# Altium schematic sheet ife18_TS_BMS_Master.SchDoc
size A
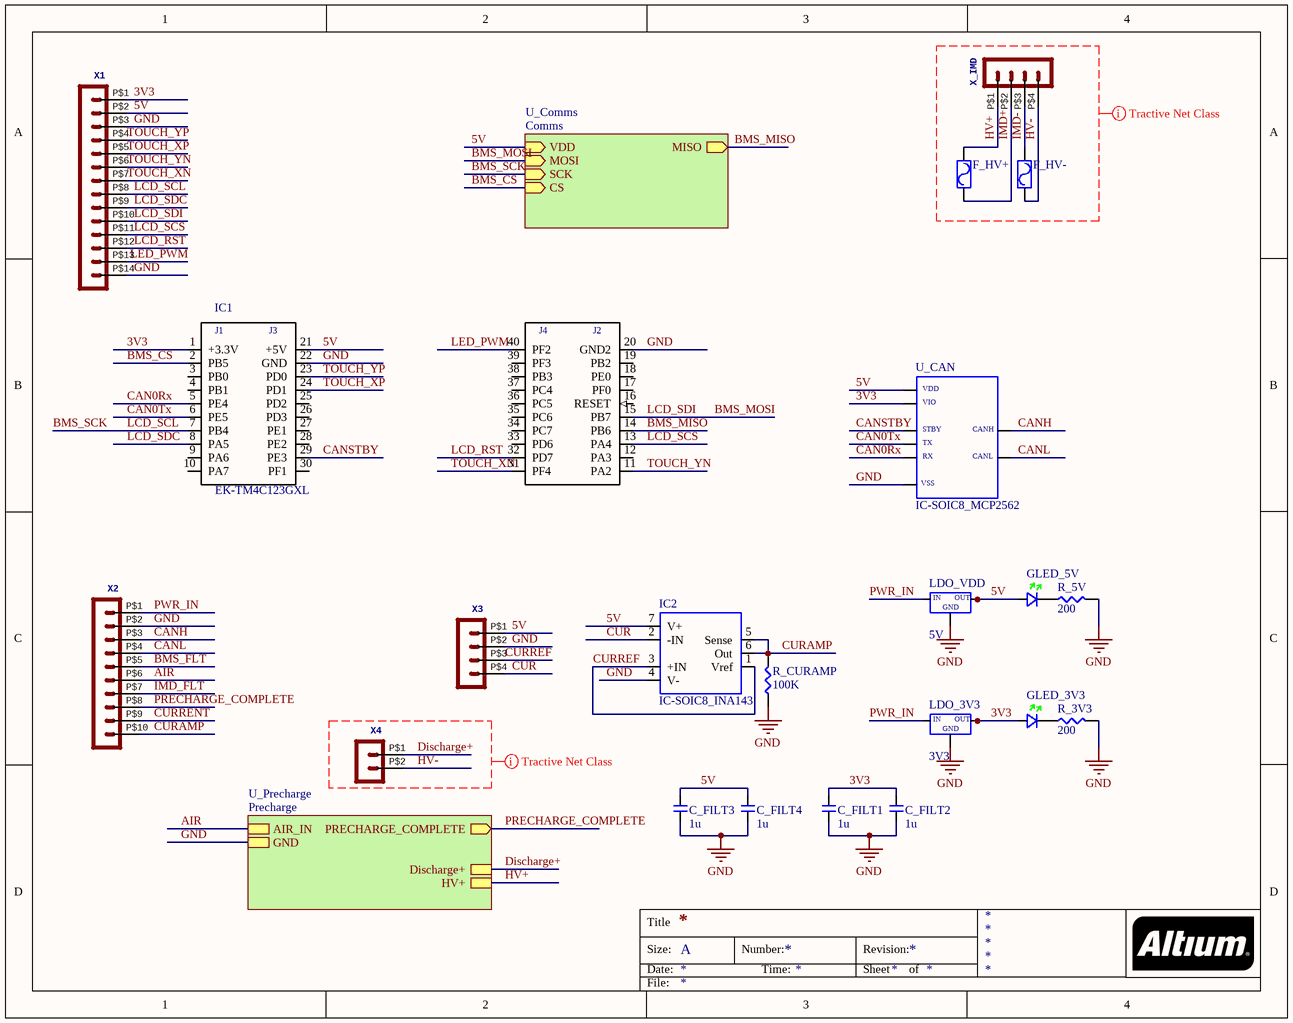
[diagram p0: ife18_TS_BMS_Master.SchDoc]

## Parts
C_FILT1  1u  [CAP-0603]
C_FILT2  1u  [CAP-0603]
C_FILT3  1u  [CAP-0603]
C_FILT4  1u  [CAP-0603]
F_HV+  (no value)  [FUSE3AG_354101]
F_HV-  (no value)  [FUSE3AG_354101]
GLED_3V3  (no value)  [LEDGREEN-0603]
GLED_5V  (no value)  [LEDGREEN-0603]
IC1  EK-TM4C123GXL  [TM4C123LAUNCHPAD]
IC2  IC-SOIC8_INA143  [SOIC8]
LDO_3V3  3V3  [SOT223]
LDO_VDD  5V  [SOT223]
R_3V3  200  [RES-0603]
R_5V  200  [RES-0603]
R_CURAMP  100K  [RES-0603]
U_CAN  IC-SOIC8_MCP2562  [SOIC8]
X1  Molex - Micro-Fit 3.0 Series connector,  3.00mm (0.118") pitch header, 14 positions.  [43045-1418]  (value not drawn)
X2  Molex - Micro-Fit 3.0 Series connector,  3.00mm (0.118") pitch header, 10 positions.  [43045-1018]  (value not drawn)
X3  Molex - Micro-Fit 3.0 Series connector,  3.00mm (0.118") pitch header, 4 positions.  [43650-0424]  (value not drawn)
X4  Molex - Micro-Fit 3.0 Series connector,  3.00mm (0.118") pitch header, 2 positions.  [43650-0224]  (value not drawn)
X_IMD  (no value)  [43650-0424]

## Sub-sheets
U_Comms = Comms: VDD (in), MOSI (in), MISO (out), SCK (in), CS (in)
U_Precharge = Precharge: PRECHARGE_COMPLETE (out), AIR_IN, GND, Discharge+, HV+

## Nets
GND: C_FILT1.1 C_FILT2.1 C_FILT3.1 C_FILT4.1 IC1.20(GND2) IC1.22(GND) IC2.4(V-) LDO_3V3.1 LDO_VDD.1 R_3V3.2 R_5V.2 R_CURAMP.1 U_CAN.2 X1.P$3 X1.P$14 X2.P$2 X3.P$2 ; sheet U_Precharge/GND
3V3: C_FILT1.2 C_FILT2.2 GLED_3V3.A IC1.1(+3.3V) LDO_3V3.2 LDO_3V3.4 U_CAN.5 X1.P$1
5V: C_FILT3.2 C_FILT4.2 GLED_5V.A IC1.21(+5V) IC2.7(V+) LDO_VDD.2 LDO_VDD.4 U_CAN.3 X1.P$2 X3.P$1 ; sheet U_Comms/VDD
AIR: X2.P$6 ; sheet U_Precharge/AIR_IN
BMS_CS: IC1.2(PB5) ; sheet U_Comms/CS
BMS_FLT: X2.P$5
BMS_MISO: IC1.14(PB6) ; sheet U_Comms/MISO
BMS_MOSI: IC1.15(PB7) X1.P$10 ; sheet U_Comms/MOSI  [also labelled LCD_SDI]
BMS_SCK: IC1.7(PB4) X1.P$8 ; sheet U_Comms/SCK  [also labelled LCD_SCL]
CAN0Rx: IC1.5(PE4) U_CAN.4
CAN0Tx: IC1.6(PE5) U_CAN.1
CANH: U_CAN.7 X2.P$3
CANL: U_CAN.6 X2.P$4
CANSTBY: IC1.29(PE3) U_CAN.8
CUR: IC2.2(-IN) X3.P$4
CURAMP: IC2.5(Sense) IC2.6(Out) R_CURAMP.2 X2.P$10
CURREF: IC2.1(Vref) IC2.3(+IN) X3.P$3
CURRENT: X2.P$9
Discharge+: X4.P$1 ; sheet U_Precharge/Discharge+
HV+: F_HV+.2 X_IMD.P$1 ; sheet U_Precharge/HV+
HV-: F_HV-.1 X4.P$2 X_IMD.P$4
IMD+: F_HV+.1 X_IMD.P$2
IMD-: F_HV-.2 X_IMD.P$3
IMD_FLT: X2.P$7
LCD_RST: IC1.32(PD7) X1.P$12
LCD_SCS: IC1.13(PA4) X1.P$11
LCD_SDC: IC1.8(PA5) X1.P$9
LED_PWM: IC1.40(PF2) X1.P$13
PRECHARGE_COMPLETE: X2.P$8 ; sheet U_Precharge/PRECHARGE_COMPLETE
PWR_IN: LDO_3V3.3 LDO_VDD.3 X2.P$1
TOUCH_XN: IC1.31(PF4) X1.P$7
TOUCH_XP: IC1.24(PD1) X1.P$5
TOUCH_YN: IC1.11(PA2) X1.P$6
TOUCH_YP: IC1.23(PD0) X1.P$4
NetGLED_3V3_K: GLED_3V3.K R_3V3.1
NetGLED_5V_K: GLED_5V.K R_5V.1

Not connected (* = marked no-connect by the designer): IC1 3(PB0) 4(PB1) 9(PA6) 10(PA7) 12(PA3) 16(RESET) 17(PF0) 18(PE0) 19(PB2) 25(PD2) 26(PD3) 27(PE1) 28(PE2) 30(PF1) 33(PD6) 34(PC7) 35(PC6) 36(PC5) 37(PC4) 38(PB3) 39(PF3)

## Layout directives
net class Tractive: Discharge+, HV+, HV-, IMD+, IMD-

## Notes on the sheet
- Title
- Size:
- Date:
- A
- Number:
- Time:
- Revision:
- Sheet
- of
- File:
- (in symbol EK-TM4C123GXL) J1; J3; J4; J2
- (in symbol IC-SOIC8_MCP2562) VDD; VIO; STBY; CANH; TX; RX; CANL; VSS
- (in symbol LDO-SOT223_SPX1117) IN; OUT; GND

## Library data of the parts
C_FILT1-C_FILT4 = CAP-0603
F_HV+ F_HV- = FUSE-354101
GLED_3V3 GLED_5V = LEDGREEN-0603
IC1 = EK-TM4C123GXL: Evaluation Kit For ARM Cortex-M4F-based Microcontrollers; MF: Texas Instruments; MP: EK-TM4C123GXL; Package: None; Price: None; SnapEDA_Link: https://www.snapeda.com/parts/EK-TM4C123GXL/Texas%20Instruments/view-part/?ref=snap; Availability: Unavailable; Value: *
LDO_3V3 LDO_VDD = LDO-SOT223_SPX1117
R_3V3 R_5V R_CURAMP = RES-0603
X1 = POS14_MF43045-1418: GateName_1: G$1; SymbolName_1: HEADER_POS14; DeviceSetName: HEADER_POS14_?; DeviceName: 43045-1418; LibraryName: MOLEX Micro-Fit; Package: 43045-1418
X2 = POS10_MF43045-1018: GateName_1: G$1; SymbolName_1: HEADER_POS10; DeviceSetName: HEADER_POS10_?; DeviceName: 43045-1018; LibraryName: MOLEX Micro-Fit; Package: 43045-1018
X3 X_IMD = POS4_MF43650-0424: GateName_1: G$1; SymbolName_1: HEADER_POS4; DeviceSetName: HEADER_POS4_?; DeviceName: 43650-0424; LibraryName: MOLEX Micro-Fit; Package: 43650-0424
X4 = POS2_MF43650-0224: GateName_1: G$1; SymbolName_1: HEADER_POS2; DeviceSetName: HEADER_POS2_?; DeviceName: 43650-0224; LibraryName: MOLEX Micro-Fit; Package: 43650-0224